# EAGLE design microSRCPShieldV1 (EAGLE 6.5.0)
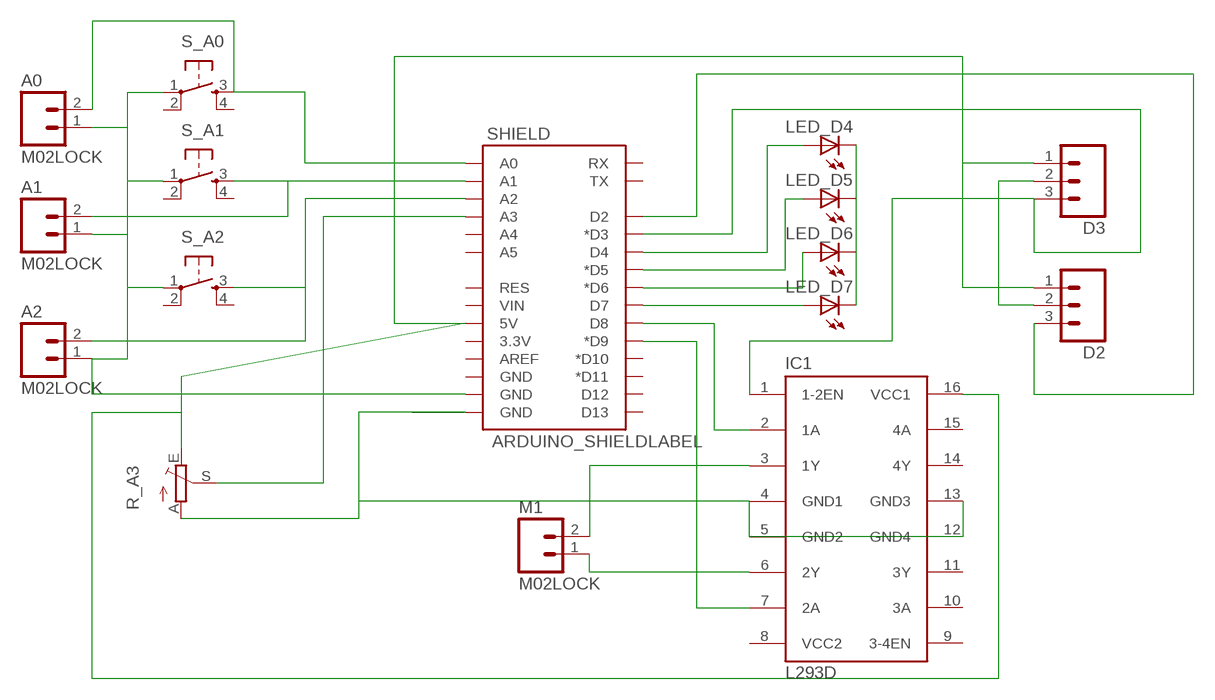
[diagram p0: schematic, sheet 1]

## Parts
A0  M02LOCK  [1X02_LOCK]
A1  M02LOCK  [1X02_LOCK]
A2  M02LOCK  [1X02_LOCK]
D2  M03LOCK  [1X03_LOCK]
D3  M03LOCK  [1X03_LOCK]
IC1  L293D  [DIL16]
LED_D4  LED3MM  [LED3MM]
LED_D5  LED3MM  [LED3MM]
LED_D6  LED3MM  [LED3MM]
LED_D7  LED3MM  [LED3MM]
M1  M02LOCK  [1X02_LOCK]
R_A3  TRIM_EU-PT10S  [PT-10S]
S_A0  TAC_SWITCHPTH  [TACTILE-PTH]
S_A1  TAC_SWITCHPTH  [TACTILE-PTH]
S_A2  TAC_SWITCHPTH  [TACTILE-PTH]
SHIELD  ARDUINO_SHIELDLABEL  [DUEMILANOVE_SHIELD]

## Nets
N$1: A1.2 S_A1.3 SHIELD.A1
N$2: LED_D6.A SHIELD.D6(*D6)
N$3: LED_D5.A SHIELD.D5(*D5)
N$4: LED_D4.A SHIELD.D4
N$5: LED_D4.K(C) LED_D5.K(C) LED_D6.K(C) LED_D7.K(C)
N$6: A2.2 S_A2.3 SHIELD.A2
N$7: LED_D7.A SHIELD.D7
N$8: A0.2 S_A0.3 SHIELD.A0
N$9: IC1.2(1A) SHIELD.D8
N$10: IC1.7(2A) SHIELD.D9(*D9)
N$11: D2.1 D3.1 IC1.16(VCC1) R_A3.E SHIELD.5V
N$12: IC1.3(1Y) M1.2
N$13: IC1.6(2Y) M1.1
N$14: R_A3.S SHIELD.A3
N$16: A0.1 A1.1 A2.1 S_A0.1 S_A1.1 S_A2.1 SHIELD.GND@1(GND)
N$17: IC1.4(GND1) IC1.5(GND2) IC1.12(GND4) IC1.13(GND3) R_A3.A SHIELD.GND@0(GND)
N$18: D2.3 SHIELD.D2
N$19: D3.3 IC1.1(1-2EN) SHIELD.D3(*D3)
N$20: D2.2 D3.2
Unconnected: IC1.9(3-4EN) IC1.10(3A) IC1.11(3Y) IC1.14(4Y) IC1.15(4A) S_A0.2 S_A0.4 S_A1.2 S_A1.4 S_A2.2 S_A2.4 SHIELD.3.3V SHIELD.A4 SHIELD.A5 SHIELD.AREF SHIELD.D10(*D10) SHIELD.D11(*D11) SHIELD.D12 SHIELD.D13 SHIELD.GND@2(GND) SHIELD.RES SHIELD.RX SHIELD.TX SHIELD.VIN

## Power pins joined to a net without a drawn wire
VCC2: IC1.8(VCC2)

## Library data of the parts
A0 A1 A2 M1 = SparkFun-Connectors:M02: Standard 2-pin 0.1" header. Use with - straight break away headers ( PRT-00116) - right angle break away headers (PRT-00553) - swiss pins (PRT-00743) - machine pins (PRT-00117) - female headers (PRT-00115) Molex polarized connector foot print use with: PRT-08233 with associated crimp pins and housings. 2.54_SCREWTERM for use with PRT-10571. 3.5mm Screw Terminal footprints for PRT-08084 5mm Screw Terminal footprints for use with PRT-08433
D2 D3 = SparkFun-Connectors:M03: Header 3 Standard 3-pin 0.1" header. Use with straight break away headers (SKU : PRT-00116), right angle break away headers (PRT-00553), swiss pins (PRT-00743), machine pins (PRT-00117), and female headers (PRT-00115). Molex polarized connector foot print use with SKU : PRT-08232 with associated crimp pins and housings.
IC1 = st-microelectronics:L293D: PUSH-PULL 4 CHANNEL DRIVER; MPN: L293D; OC_FARNELL: 9589619; OC_NEWARK: 56P8249
LED_D4-LED_D7 = led:LED: LED OSRAM: - CHIPLED LG R971, LG N971, LY N971, LG Q971, LY Q971, LO R971, LY R971 LH N974, LH R974 LS Q976, LO Q976, LY Q976 LO Q996 - Hyper CHIPLED LW Q18S LB Q993, LB Q99A, LB R99A - SideLED LS A670, LO A670, LY A670, LG A670, LP A670 LB A673, LV A673, LT A673, LW A673 LH A674 LY A675 LS A676, LA A676, LO A676, LY A676, LW A676 LS A679, LY A679, LG A679 - Hyper Micro SIDELED® LS Y876, LA Y876, LO Y876, LY Y876 LT Y87S - SmartLED LW L88C, LW L88S LB L89C, LB L89S, LG L890 LS L89K, LO L89K, LY L89K LS L896, LA L896, LO L896, LY L896 - TOPLED LS T670, LO T670, LY T670, LG T670, LP T670 LSG T670, LSP T670, LSY T670, LOP T670, LYG T670 LG T671, LOG T671, LSG T671 LB T673, LV T673, LT T673, LW T673 LH T674 LS T676, LA T676, LO T676, LY T676, LB T676, LH T676, LSB T676, LW T676 LB T67C, LV T67C, LT T67C, LS T67K, LO T67K, LY T67K, LW E67C LS E67B, LA E67B, LO E67B, LY E67B, LB E67C, LV E67C, LT E67C LW T67C LS T679, LY T679, LG T679 LS T770, LO T770, LY T770, LG T770, LP T770 LB T773, LV T773, LT T773, LW T773 LH T774 LS E675, LA E675, LY E675, LS T675 LS T776, LA T776, LO T776, LY T776, LB T776 LHGB T686 LT T68C, LB T68C - Hyper Mini TOPLED® LB M676 - Mini TOPLED Santana® LG M470 LS M47K, LO M47K, LY M47K Source: http://www.osram.convergy.de LUXEON: - LUMILED® LXK2-PW12-R00, LXK2-PW12-S00, LXK2-PW14-U00, LXK2-PW14-V00 LXK2-PM12-R00, LXK2-PM12-S00, LXK2-PM14-U00 LXK2-PE12-Q00, LXK2-PE12-R00, LXK2-PE12-S00, LXK2-PE14-T00, LXK2-PE14-U00 LXK2-PB12-K00, LXK2-PB12-L00, LXK2-PB12-M00, LXK2-PB14-N00, LXK2-PB14-P00, LXK2-PB14-Q00 LXK2-PR12-L00, LXK2-PR12-M00, LXK2-PR14-Q00, LXK2-PR14-R00 LXK2-PD12-Q00, LXK2-PD12-R00, LXK2-PD12-S00 LXK2-PH12-R00, LXK2-PH12-S00 LXK2-PL12-P00, LXK2-PL12-Q00, LXK2-PL12-R00 Source: www.luxeon.com KINGBRIGHT: KA-3528ASYC Source: www.kingbright.com
R_A3 = pot:TRIM_EU-: POTENTIOMETER
S_A0 S_A1 S_A2 = SparkFun-Electromechanical:TAC_SWITCH: Momentary Switch Button commonly used for reset or general input. Spark Fun Electronics SKU : COM-00097 SMT- SWCH-08247
SHIELD = SparkFun-Boards:ARDUINO_SHIELD: Arduino shield footprint

## Board
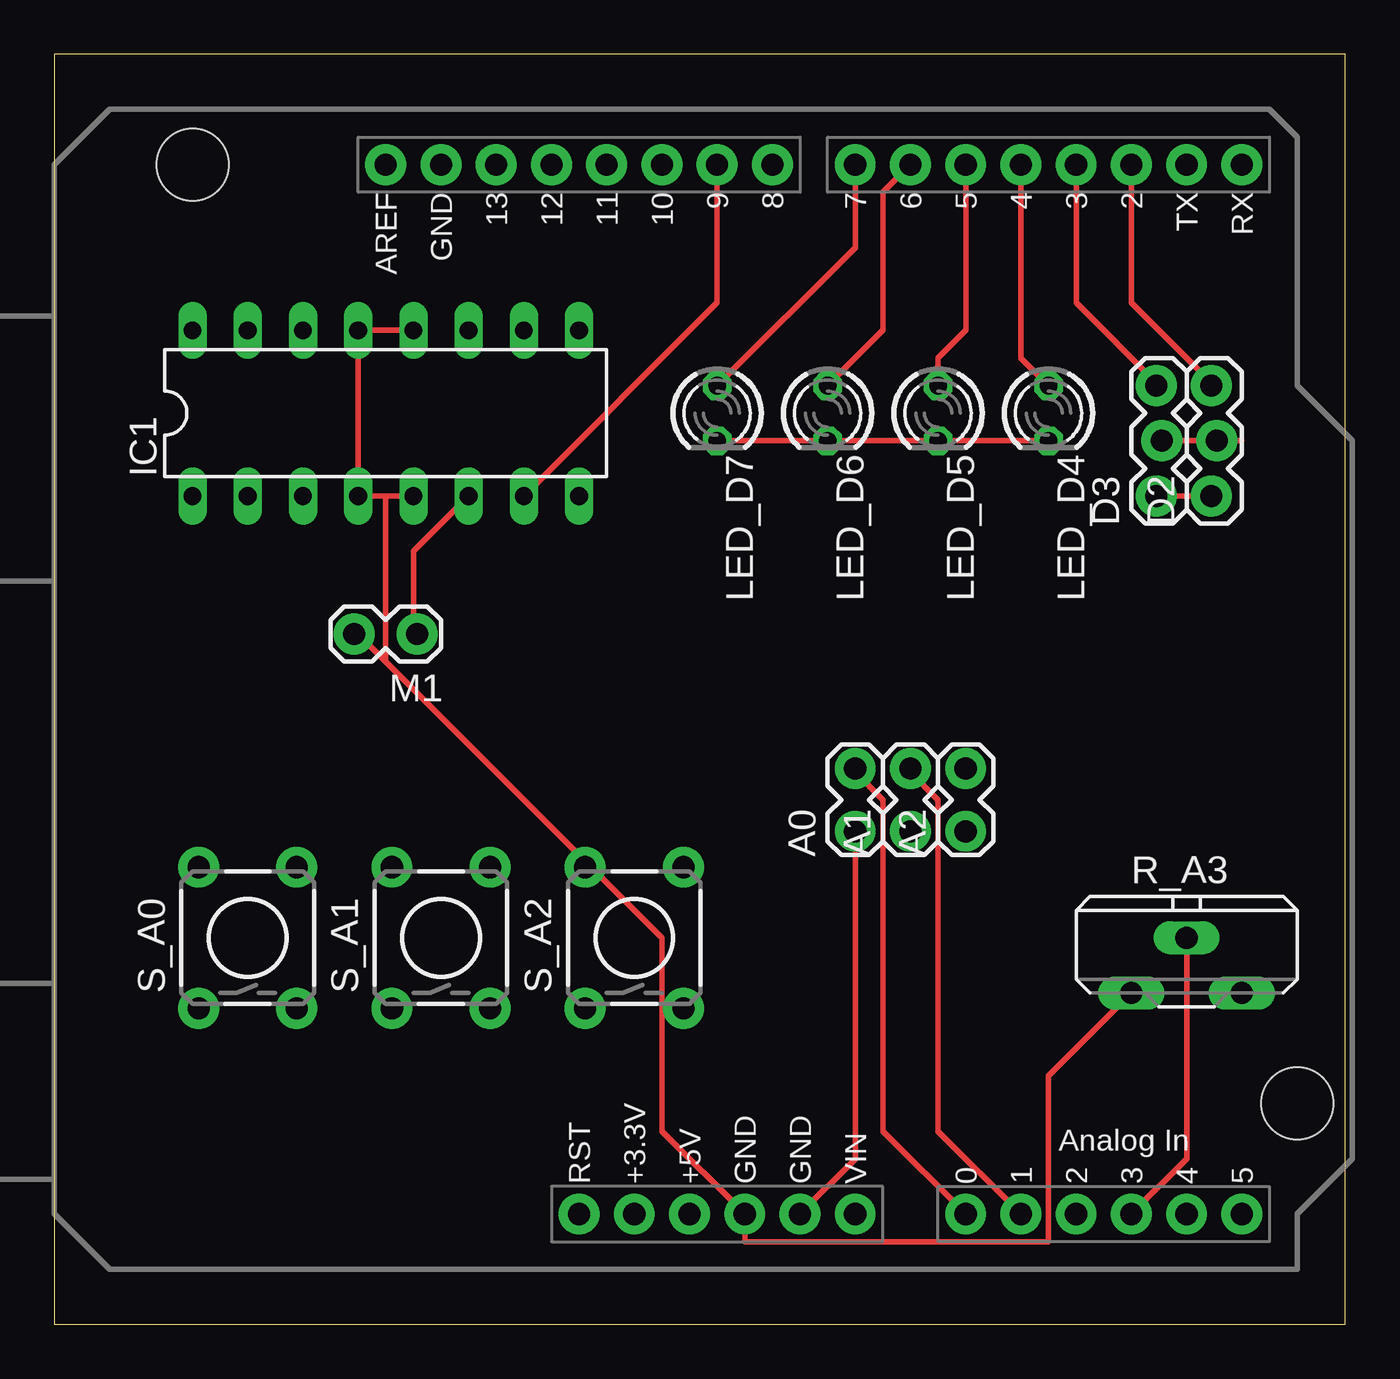
[diagram p1: board, top side]
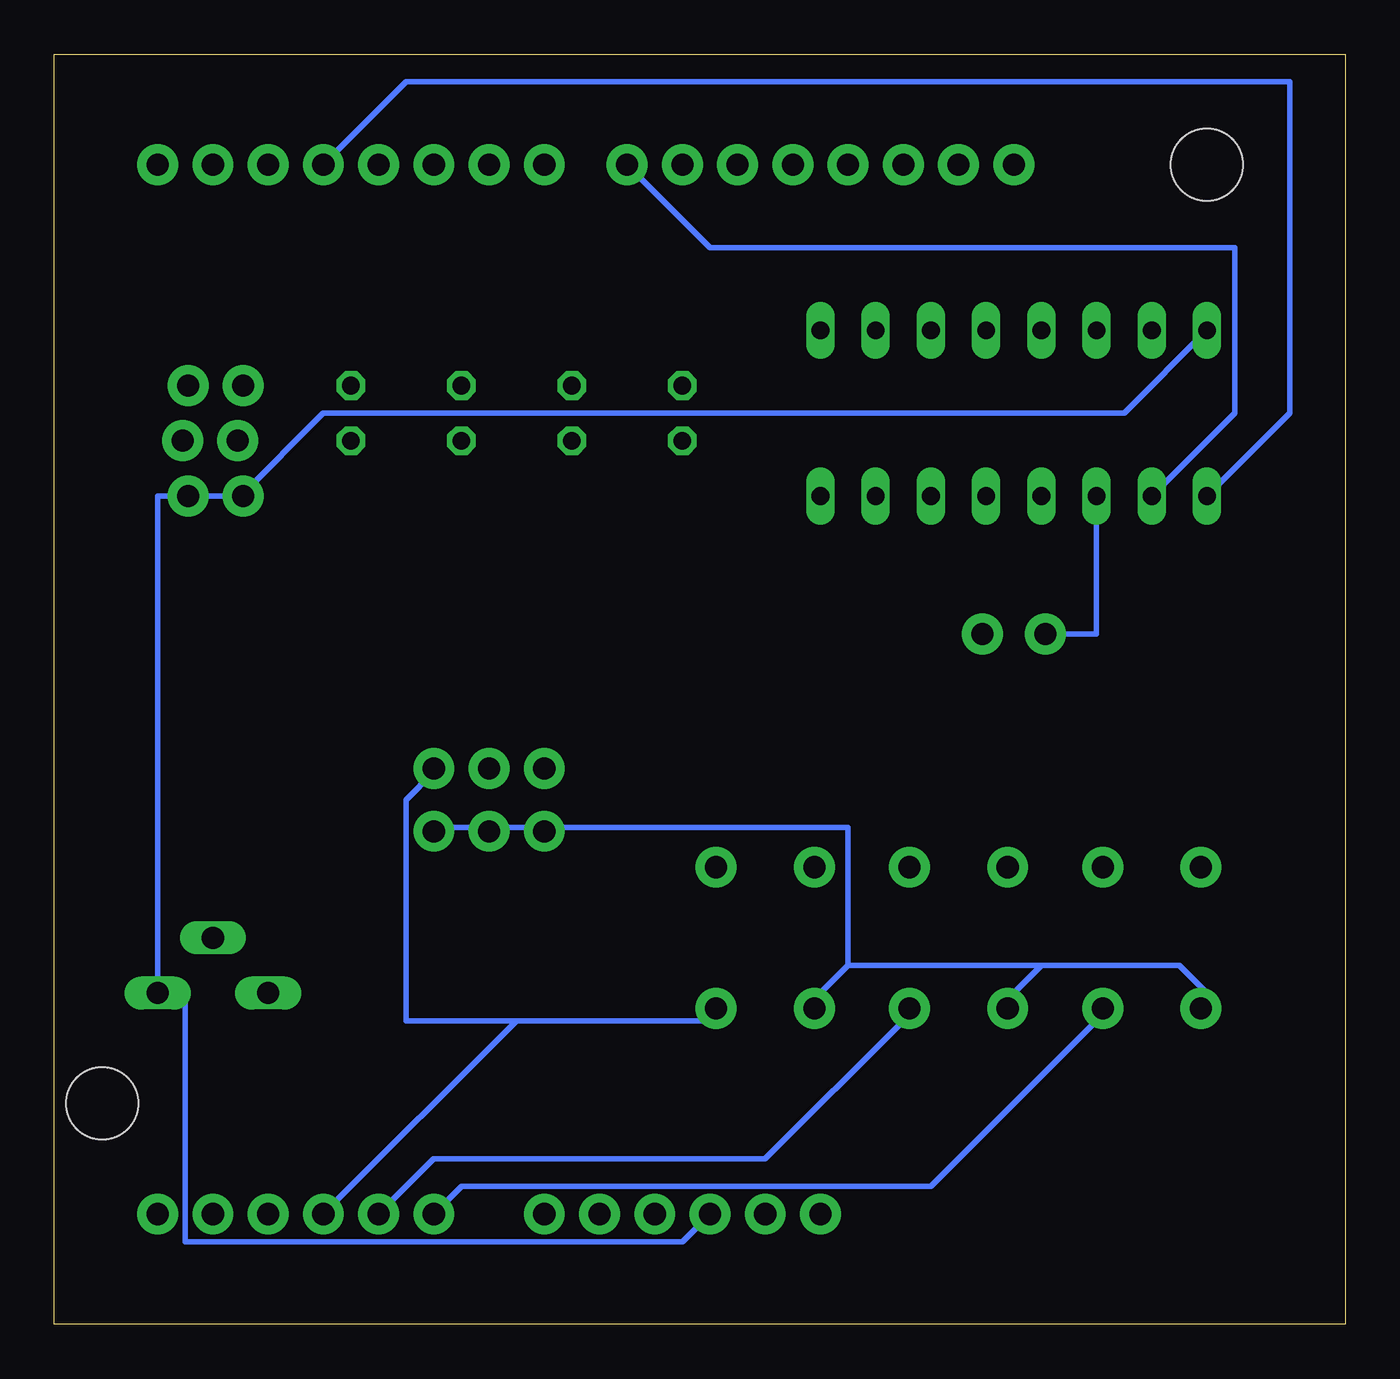
[diagram p2: board, bottom side, seen from below]

Size 59.36 x 58.41 mm. Coordinates in mm from the lower left corner, seen from the top.
Outline: 0,0 59.36,0 59.36,58.41 0,58.41 0,0
Copper layers (1*16): Top 0.035mm / dielectric 1.5mm / Bottom 0.035mm
Design rules "default": minimum track width 10mil, minimum drill 24mil, track to track 8mil, track to pad 8mil, pad to pad 8mil, via to via 8mil, smd to smd 8mil, copper to edge 40mil, drill to drill 8mil, minimum pad ring 10mil, minimum via ring 8mil, stop-mask expansion 4mil, vias tented up to drill 0mil, thermal gap 10mil

### Footprints (pad centres in the part's own frame; a part is rotated, then mirrored left to right if it is on the bottom)
1X02_LOCK = drill 1.016 pad 1.88: 1 -0.178,0; 2 2.718,0
1X03_LOCK = drill 1.016 pad 1.88: 1 0,0.127; 2 2.54,-0.127; 3 5.08,0.127
DIL16 = drill 0.813 long: 1 -8.89,-3.81; 2 -6.35,-3.81; 3 -3.81,-3.81; 4 -1.27,-3.81; 5 1.27,-3.81; 6 3.81,-3.81; 7 6.35,-3.81; 8 8.89,-3.81; 9 8.89,3.81; 10 6.35,3.81; 11 3.81,3.81; 12 1.27,3.81; 13 -1.27,3.81; 14 -3.81,3.81; 15 -6.35,3.81; 16 -8.89,3.81
LED3MM = drill 0.813 octagon: A -1.27,0; K 1.27,0
PT-10S = drill 1.016 long: A -2.54,-1.27; E 2.54,-1.27; S 0,1.27
TACTILE-PTH = drill 1.016 pad 1.88: 1 -3.251,2.261; 2 3.251,2.261; 3 -3.251,-2.261; 4 3.251,-2.261
DUEMILANOVE_SHIELD = drill 1.016 pad 1.88: 3.3V 50.8,26.67; 5V 50.8,29.21; A0 50.8,41.91; A1 50.8,44.45; A2 50.8,46.99; A3 50.8,49.53; A4 50.8,52.07; A5 50.8,54.61; AREF 2.54,15.24; D2 2.54,49.53; D3 2.54,46.99; D4 2.54,44.45; D5 2.54,41.91; D6 2.54,39.37; D7 2.54,36.83; D8 2.54,33.02; D9 2.54,30.48; D10 2.54,27.94; D11 2.54,25.4; D12 2.54,22.86; D13 2.54,20.32; GND@0 50.8,31.75; GND@1 50.8,34.29; GND@2 2.54,17.78; RES 50.8,24.13; RX 2.54,54.61; TX 2.54,52.07; VIN 50.8,36.83 | hole 3.302: 45.72,57.15; 2.54,6.35

### Placement (x,y rotation side)
A0  36.83,22.86 90 top
A1  39.37,22.86 90 top
A2  41.91,22.86 90 top
D2  53.34,38.1 90 top
D3  50.8,38.1 90 top
IC1  15.24,41.91 0 top
LED_D4  45.72,41.91 270 top
LED_D5  40.64,41.91 270 top
LED_D6  35.56,41.91 270 top
LED_D7  30.48,41.91 270 top
M1  16.51,31.75 180 top
R_A3  52.07,16.51 0 top
S_A0  8.89,17.78 90 top
S_A1  17.78,17.78 90 top
S_A2  26.67,17.78 90 top
SHIELD  0,55.88 270 top

### Tracks (layer width: path | path; a pad name or v marks a point on that pad's centre or on a via)
N$1
  Top 0.254: SHIELD.A1 40.64,8.89 40.64,24.13 39.37,25.4 A1.2
  Bottom 0.254: SHIELD.A1 41.91,7.62 26.67,7.62 20.32,13.97 S_A1.3
N$2
  Top 0.254: SHIELD.D6 38.1,52.07 38.1,45.72 LED_D6.A
N$3
  Top 0.254: LED_D5.A 40.64,44.45 41.91,45.72 SHIELD.D5
N$4
  Top 0.254: LED_D4.A 44.45,44.45 SHIELD.D4
N$5
  Top 0.254: LED_D7.K LED_D6.K LED_D5.K LED_D4.K
N$6
  Bottom 0.254: 38.1,13.97 SHIELD.A2 | 38.1,13.97 29.21,13.97 S_A2.3 | 38.1,13.97 43.18,13.97 43.18,24.13 41.91,25.4 A2.2
N$7
  Top 0.254: LED_D7.A 36.83,49.53 SHIELD.D7
N$8
  Top 0.254: SHIELD.A0 38.1,8.89 38.1,24.13 36.83,25.4 A0.2
  Bottom 0.254: SHIELD.A0 40.64,6.35 19.05,6.35 11.43,13.97 S_A0.3
N$9
  Bottom 0.254: SHIELD.D8 29.21,49.53 5.08,49.53 5.08,41.91 IC1.2
N$10
  Top 0.254: IC1.7 30.48,46.99 SHIELD.D9
N$11
  Top 0.254: D2.1 D3.1
  Bottom 0.254: 50.8,38.1 54.61,38.1 R_A3.E 53.34,15.24 53.34,3.81 30.48,3.81 SHIELD.5V | IC1.16 10.16,41.91 46.99,41.91 50.8,38.1 | 50.8,38.1 D3.1
N$12
  Bottom 0.254: IC1.3 11.43,31.75 M1.2 13.97,31.75
N$13
  Top 0.254: IC1.6 16.51,35.56 16.51,31.75 M1.1
N$14
  Top 0.254: R_A3.S 52.07,7.62 SHIELD.A3
N$16
  Top 0.254: SHIELD.GND@1 36.83,7.62 A0.1 36.83,22.86
  Bottom 0.254: 36.83,22.86 39.37,22.86 | 39.37,22.86 41.91,22.86 A2.1 | 39.37,22.86 A1.1 | 13.97,16.51 7.62,16.51 6.35,15.24 S_A0.1 | 13.97,16.51 15.24,15.24 S_A1.1 | 22.86,16.51 24.13,15.24 S_A2.1 | 13.97,16.51 22.86,16.51 | 22.86,16.51 22.86,22.86 36.83,22.86 | 36.83,22.86 A0.1
N$17
  Top 0.254: IC1.12 IC1.13 IC1.4 15.24,38.1 | R_A3.A 45.72,11.43 45.72,3.81 31.75,3.81 SHIELD.GND@0 27.94,8.89 27.94,17.78 15.24,30.48 | 15.24,30.48 13.97,31.75 | IC1.5 15.24,38.1 | 15.24,30.48 15.24,38.1
N$18
  Top 0.254: SHIELD.D2 49.53,46.99 53.34,43.18 D2.3
N$19
  Top 0.254: SHIELD.D3 46.99,46.99 50.8,43.18 D3.3
  Bottom 0.254: IC1.1 2.54,41.91 2.54,57.15 43.18,57.15 SHIELD.D3
N$20
  Top 0.254: D2.2 D3.2 54.61,40.64